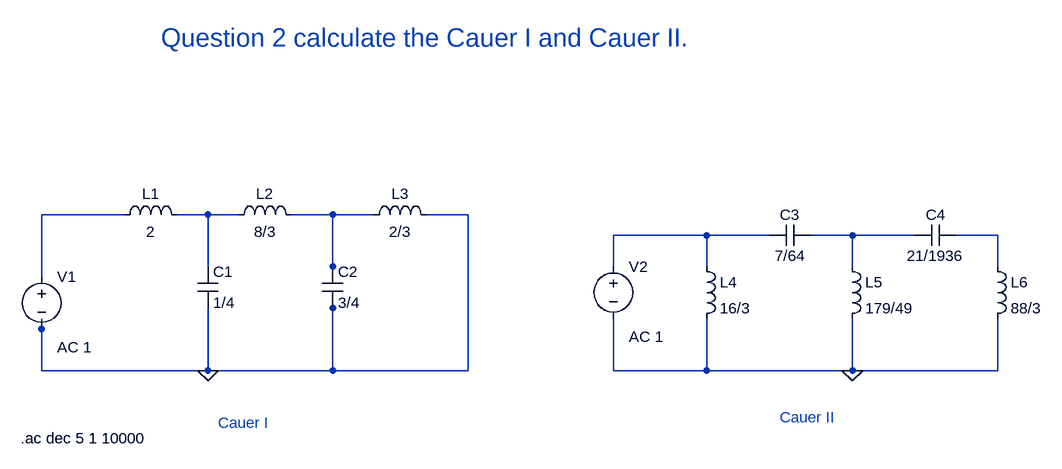
[diagram p0: schematic 2_Dheerendra_23EE019_Network_synthesis.asc]
2_Dheerendra_23EE019_Network_synthesis.asc, the LTspice schematic file:
Version 4
SHEET 1 1312 696
WIRE -112 336 -240 336
WIRE 16 336 -32 336
WIRE 64 336 16 336
WIRE 208 336 144 336
WIRE 272 336 208 336
WIRE 416 336 352 336
WIRE 784 368 640 368
WIRE 880 368 784 368
WIRE 1008 368 944 368
WIRE 1104 368 1008 368
WIRE 1232 368 1168 368
WIRE 16 416 16 336
WIRE 208 416 208 336
WIRE 640 416 640 368
WIRE 784 416 784 368
WIRE 1008 416 1008 368
WIRE 1232 416 1232 368
WIRE -240 432 -240 336
WIRE 208 432 208 416
WIRE 208 480 208 464
WIRE -240 512 -240 496
WIRE -240 576 -240 512
WIRE 16 576 16 480
WIRE 16 576 -240 576
WIRE 208 576 208 480
WIRE 208 576 16 576
WIRE 416 576 416 336
WIRE 416 576 208 576
WIRE 640 576 640 496
WIRE 784 576 784 496
WIRE 784 576 640 576
WIRE 1008 576 1008 496
WIRE 1008 576 784 576
WIRE 1232 576 1232 496
WIRE 1232 576 1008 576
FLAG 16 576 0
FLAG 1008 576 0
SYMBOL ind -128 352 R270
WINDOW 0 32 56 VTop 2
WINDOW 3 5 56 VBottom 2
SYMATTR InstName L1
SYMATTR Value 2
SYMBOL ind 48 352 R270
WINDOW 0 32 56 VTop 2
WINDOW 3 5 56 VBottom 2
SYMATTR InstName L2
SYMATTR Value 8/3
SYMBOL ind 256 352 R270
WINDOW 0 32 56 VTop 2
WINDOW 3 5 56 VBottom 2
SYMATTR InstName L3
SYMATTR Value 2/3
SYMBOL cap 0 416 R0
SYMATTR InstName C1
SYMATTR Value 1/4
SYMBOL cap 192 416 R0
SYMATTR InstName C2
SYMATTR Value 3/4
SYMBOL voltage -240 416 R0
WINDOW 123 24 124 Left 2
WINDOW 39 0 0 Left 0
SYMATTR InstName V1
SYMATTR Value ""
SYMATTR Value2 AC 1
SYMBOL ind 768 400 R0
SYMATTR InstName L4
SYMATTR Value 16/3
SYMBOL ind 992 400 R0
SYMATTR InstName L5
SYMATTR Value 179/49
SYMBOL ind 1216 400 R0
SYMATTR InstName L6
SYMATTR Value 88/3
SYMBOL cap 944 352 R90
WINDOW 0 0 32 VBottom 2
WINDOW 3 32 32 VTop 2
SYMATTR InstName C3
SYMATTR Value 7/64
SYMBOL cap 1168 352 R90
WINDOW 0 0 32 VBottom 2
WINDOW 3 32 32 VTop 2
SYMATTR InstName C4
SYMATTR Value 21/1936
SYMBOL voltage 640 400 R0
WINDOW 123 24 124 Left 2
WINDOW 39 0 0 Left 0
SYMATTR InstName V2
SYMATTR Value ""
SYMATTR Value2 AC 1
TEXT -56 64 Left 4 ;Question 2 calculate the Cauer I and Cauer II.
TEXT 32 656 Left 2 ;Cauer I
TEXT 896 648 Left 2 ;Cauer II
TEXT -272 680 Left 2 !.ac dec 5 1 10000

The netlist it stands for:
* 2_Dheerendra_23EE019_Network_synthesis.asc
L1 N001 N002 2
L2 N002 N003 8/3
L3 N003 0 2/3
C1 N002 0 1/4
C2 N003 0 3/4
V1 N001 0 AC 1
L4 N004 0 16/3
L5 N005 0 179/49
L6 N006 0 88/3
C3 N005 N004 7/64
C4 N006 N005 21/1936
V2 N004 0 AC 1
* Question 2 calculate the Cauer I and Cauer II.
* Cauer I
* Cauer II
.ac dec 5 1 10000
.backanno
.end